# EAGLE design DriverMosfet_2 (EAGLE 7.2.0)
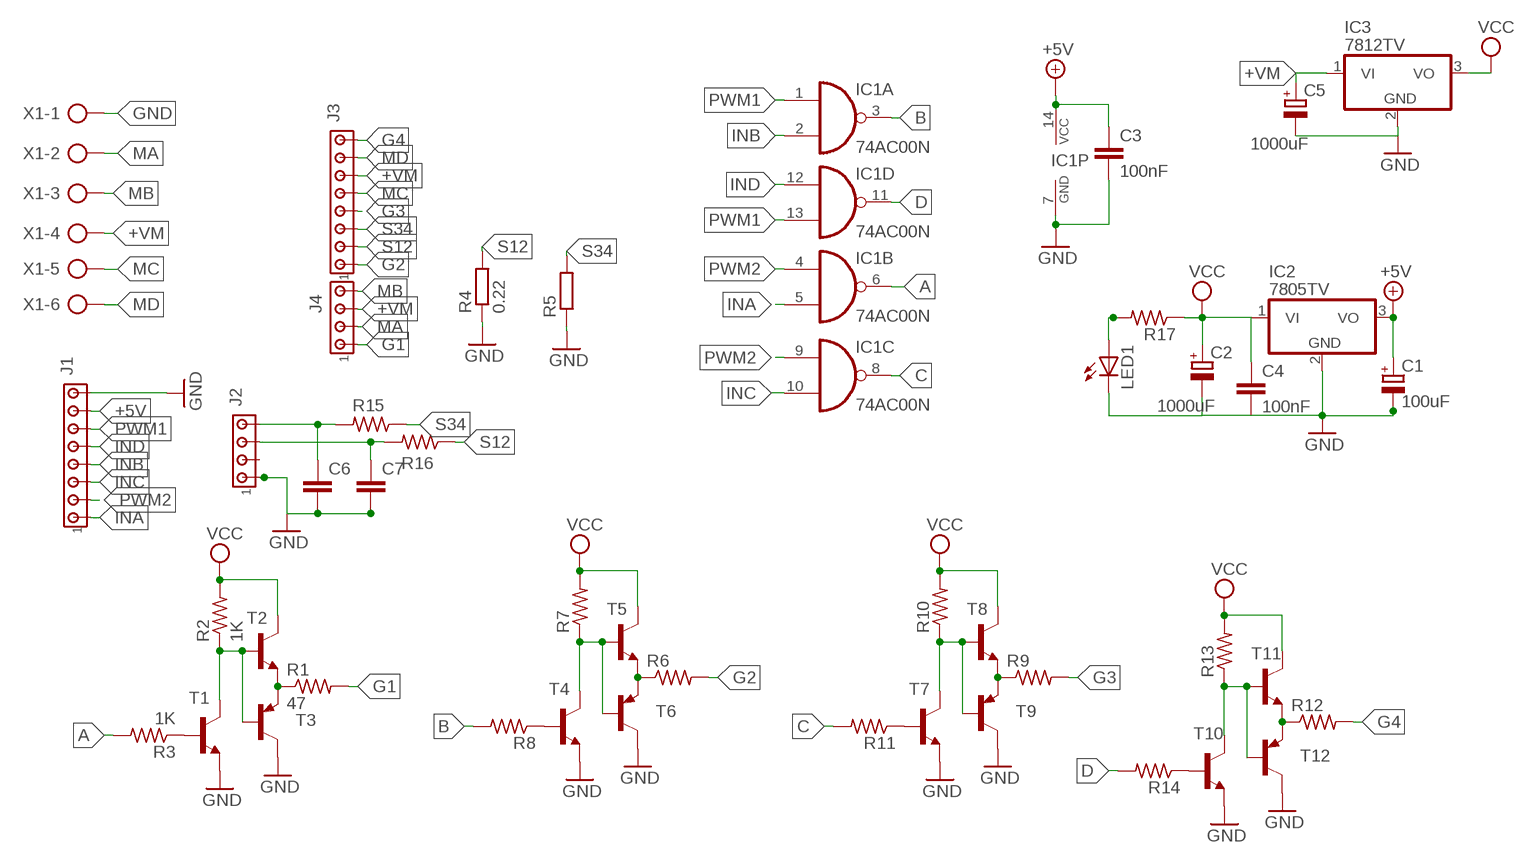
[diagram p0: schematic, sheet 1]

## Parts
C1  100uF  CPOL-EUE2.5-6  [E2,5-6]
C2  1000uF  CPOL-EUE2.5-7  [E2,5-7]
C3  100nF  C-EU050-025X075  [C050-025X075]
C4  100nF  C-EU050-025X075  [C050-025X075]
C5  1000uF  CPOL-EUE3.5-10  [E3,5-10]
C6  C-EU025-030X050  [C025-030X050]
C7  C-EU025-030X050  [C025-030X050]
IC1  74AC00N  [DIL14]
IC2  7805TV  [TO220V]
IC3  7812TV  [TO220V]
J1  MTA08-100  [10X08MTA]
J2  MTA04-100  [10X04MTA]
J3  MTA08-100  [10X08MTA]
J4  MTA04-100  [10X04MTA]
LED1  LED3MM  [LED3MM]
R1  47  R-US_0207/7  [0207/7]
R2  1K  R-US_0207/7  [0207/7]
R3  1K  R-US_0207/7  [0207/7]
R4  0.22  R-EU_0613/15  [P0613/15]
R5  R-EU_0414/15  [0414/15]
R6  R-US_0207/7  [0207/7]
R7  R-US_0207/7  [0207/7]
R8  R-US_0207/7  [0207/7]
R9  R-US_0207/7  [0207/7]
R10  R-US_0207/7  [0207/7]
R11  R-US_0207/7  [0207/7]
R12  R-US_0207/7  [0207/7]
R13  R-US_0207/7  [0207/7]
R14  R-US_0207/7  [0207/7]
R15  R-US_0207/7  [0207/7]
R16  R-US_0207/7  [0207/7]
R17  R-US_0207/7  [0207/7]
T1  BC547-NPN-TO92-CBE  [TO92-CBE]
T2  BC547-NPN-TO92-CBE  [TO92-CBE]
T3  BC557A-PNP-TO92-EBC  [TO92-EBC]
T4  BC547-NPN-TO92-CBE  [TO92-CBE]
T5  BC547-NPN-TO92-CBE  [TO92-CBE]
T6  BC557A-PNP-TO92-EBC  [TO92-EBC]
T7  BC547-NPN-TO92-CBE  [TO92-CBE]
T8  BC547-NPN-TO92-CBE  [TO92-CBE]
T9  BC557A-PNP-TO92-EBC  [TO92-EBC]
T10  BC547-NPN-TO92-CBE  [TO92-CBE]
T11  BC547-NPN-TO92-CBE  [TO92-CBE]
T12  BC557A-PNP-TO92-EBC  [TO92-EBC]
X1  AK500/6-H  [AK500/6-H]

## Nets
+5V: C1.+ C3.1 IC1.14(P:VCC) IC2.3(VO) J1.7
+VM: C5.+ IC3.1(VI) J3.6 J4.3 X1.4
A: IC1.6(B:O) R3.2
B: IC1.3(A:O) R8.2
C: IC1.8(C:O) R11.2
D: IC1.11(D:O) R14.2
G1: J4.1 R1.2
G2: J3.1 R6.2
G3: J3.4 R9.2
G4: J3.8 R12.2
GND: C1.- C2.- C3.2 C4.2 C5.- C6.2 C7.2 IC1.7(P:GND) IC2.2(GND) IC3.2(GND) J1.8 J2.1 LED1.K(C) R4.1 R5.1 T1.E T3.C T4.E T6.C T7.E T9.C T10.E T12.C X1.1
INA: IC1.5(B:I1) J1.1
INB: IC1.2(A:I1) J1.4
INC: IC1.10(C:I1) J1.3
IND: IC1.12(D:I0) J1.5
MA: J4.2 X1.2
MB: J4.4 X1.3
MC: J3.5 X1.5
MD: J3.7 X1.6
N$1: R1.1 T2.E T3.E
N$2: R3.1 T1.B
N$4: C6.1 J2.4 R15.2
N$5: R2.1 T1.C T2.B T3.B
N$6: C7.1 J2.3 R16.2
N$10: R6.1 T5.E T6.E
N$11: R8.1 T4.B
N$13: LED1.A R17.2
N$15: R7.1 T4.C T5.B T6.B
N$19: R9.1 T8.E T9.E
N$20: R11.1 T7.B
N$21: R10.1 T7.C T8.B T9.B
N$25: R12.1 T11.E T12.E
N$26: R14.1 T10.B
N$27: R13.1 T10.C T11.B T12.B
PWM1: IC1.1(A:I0) IC1.13(D:I1) J1.6
PWM2: IC1.4(B:I0) IC1.9(C:I0) J1.2
S12: J3.2 R4.2 R16.1
S34: J3.3 R5.2 R15.1
VCC: C2.+ C4.1 IC2.1(VI) IC3.3(VO) R2.2 R7.2 R10.2 R13.2 R17.1 T2.C T5.C T8.C T11.C
Unconnected: J2.2

## Library data of the parts
C1 C2 C5 = rcl:CPOL-EU: POLARIZED CAPACITOR, European symbol
C3 C4 C6 C7 = rcl:C-EU: CAPACITOR, European symbol
IC1 = 74xx-eu:74*00: Quad 2-input NAND gate
IC2 IC3 = linear:78*: Positive VOLTAGE REGULATOR Source: http://cache.national.com/ds/LM/LM78L05.pdf http://www.fairchildsemi.com/ds/LM/LM7805.pdf
J1 J3 = con-amp:MTA08-100: AMP connector
J2 J4 = con-amp:MTA04-100: AMP connector
LED1 = led:LED: LED OSRAM: - CHIPLED LG R971, LG N971, LY N971, LG Q971, LY Q971, LO R971, LY R971 LH N974, LH R974 LS Q976, LO Q976, LY Q976 LO Q996 - Hyper CHIPLED LW Q18S LB Q993, LB Q99A, LB R99A - SideLED LS A670, LO A670, LY A670, LG A670, LP A670 LB A673, LV A673, LT A673, LW A673 LH A674 LY A675 LS A676, LA A676, LO A676, LY A676, LW A676 LS A679, LY A679, LG A679 - Hyper Micro SIDELED® LS Y876, LA Y876, LO Y876, LY Y876 LT Y87S - SmartLED LW L88C, LW L88S LB L89C, LB L89S, LG L890 LS L89K, LO L89K, LY L89K LS L896, LA L896, LO L896, LY L896 - TOPLED LS T670, LO T670, LY T670, LG T670, LP T670 LSG T670, LSP T670, LSY T670, LOP T670, LYG T670 LG T671, LOG T671, LSG T671 LB T673, LV T673, LT T673, LW T673 LH T674 LS T676, LA T676, LO T676, LY T676, LB T676, LH T676, LSB T676, LW T676 LB T67C, LV T67C, LT T67C, LS T67K, LO T67K, LY T67K, LW E67C LS E67B, LA E67B, LO E67B, LY E67B, LB E67C, LV E67C, LT E67C LW T67C LS T679, LY T679, LG T679 LS T770, LO T770, LY T770, LG T770, LP T770 LB T773, LV T773, LT T773, LW T773 LH T774 LS E675, LA E675, LY E675, LS T675 LS T776, LA T776, LO T776, LY T776, LB T776 LHGB T686 LT T68C, LB T68C - Hyper Mini TOPLED® LB M676 - Mini TOPLED Santana® LG M470 LS M47K, LO M47K, LY M47K Source: http://www.osram.convergy.de LUXEON: - LUMILED® LXK2-PW12-R00, LXK2-PW12-S00, LXK2-PW14-U00, LXK2-PW14-V00 LXK2-PM12-R00, LXK2-PM12-S00, LXK2-PM14-U00 LXK2-PE12-Q00, LXK2-PE12-R00, LXK2-PE12-S00, LXK2-PE14-T00, LXK2-PE14-U00 LXK2-PB12-K00, LXK2-PB12-L00, LXK2-PB12-M00, LXK2-PB14-N00, LXK2-PB14-P00, LXK2-PB14-Q00 LXK2-PR12-L00, LXK2-PR12-M00, LXK2-PR14-Q00, LXK2-PR14-R00 LXK2-PD12-Q00, LXK2-PD12-R00, LXK2-PD12-S00 LXK2-PH12-R00, LXK2-PH12-S00 LXK2-PL12-P00, LXK2-PL12-Q00, LXK2-PL12-R00 Source: www.luxeon.com KINGBRIGHT: KA-3528ASYC Source: www.kingbright.com
R1-R3 R6-R17 = rcl:R-US_: RESISTOR, American symbol; SPICEPREFIX: R
R4 R5 = resistor:R-EU_: RESISTOR, European symbol
T1 T2 T4 T5 T7 T8 T10 T11 = transistor:*-NPN-: NPN Transistror BF959 corrected 2008.03.06
T3 T6 T9 T12 = transistor:*-PNP-: PNP Transistror
X1 = con-ptr500:AK500/6-H: CONNECTOR Aug. 2004 / PTR Meßtechnik: Die Bezeichnung der Serie AK505 wurde geändert. Es handelt sich hierbei um AK500 in horizontaler Ausführung.

## Board
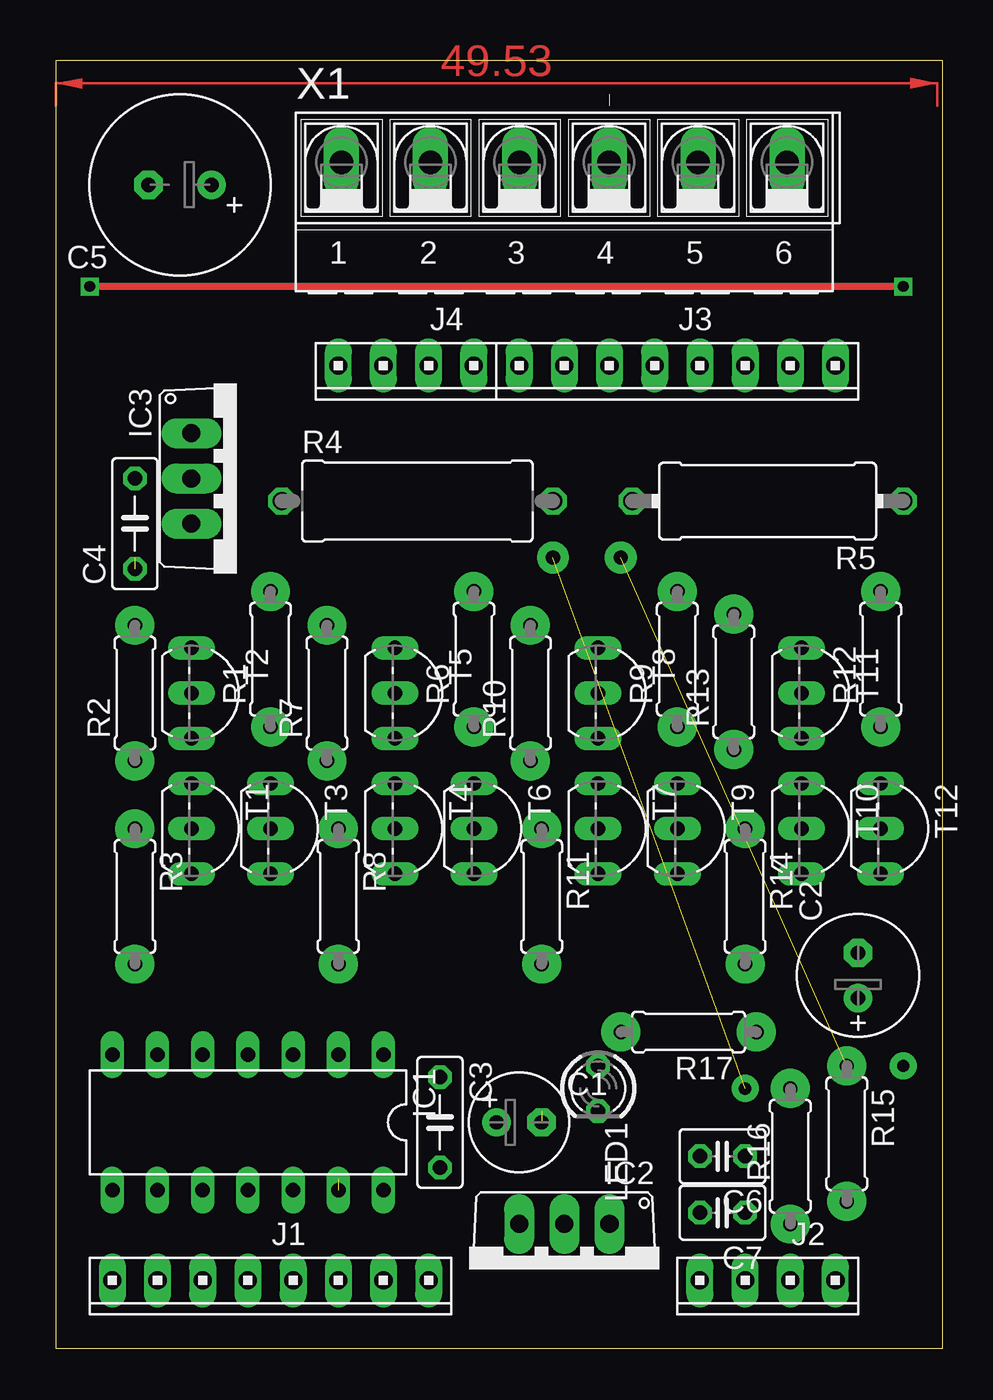
[diagram p1: board, top side]
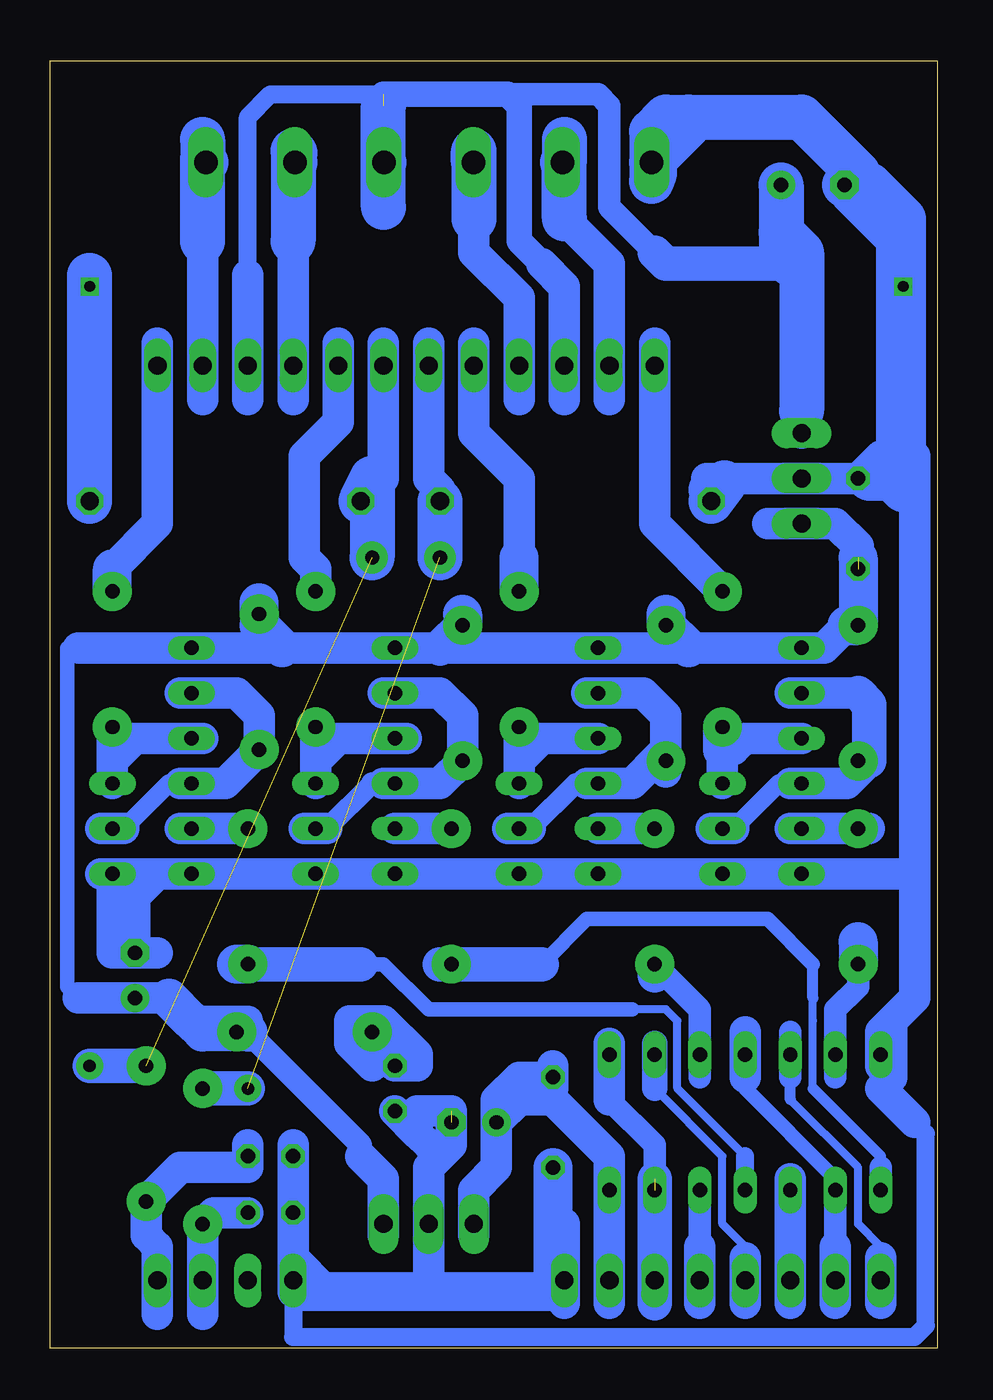
[diagram p2: board, bottom side, seen from below]

Size 49.84 x 72.38 mm. Coordinates in mm from the lower left corner, seen from the top.
Outline: 0,0 49.84,0 49.84,72.38 0,72.38 0,0
Copper layers (1*16): Top 0.035mm / dielectric 1.5mm / Bottom 0.035mm
Design rules "default": minimum track width 10mil, minimum drill 24mil, track to track 8mil, track to pad 8mil, pad to pad 8mil, via to via 8mil, smd to smd 8mil, copper to edge 40mil, drill to drill 8mil, minimum pad ring 10mil, minimum via ring 8mil, stop-mask expansion 4mil, vias tented up to drill 0mil, thermal gap 10mil

### Footprints (pad centres in the part's own frame; a part is rotated, then mirrored left to right if it is on the bottom)
E2,5-6 = drill 0.813 pad 1.6: + -1.27,0 | drill 0.813 pad 1.6 octagon: - 1.27,0
E2,5-7 = drill 0.813 pad 1.6: + -1.27,0 | drill 0.813 pad 1.6 octagon: - 1.27,0
C050-025X075 = drill 0.813 octagon: 1 -2.54,0; 2 2.54,0
E3,5-10 = drill 0.813 pad 1.6: + -1.778,0 | drill 0.813 pad 1.6 octagon: - 1.778,0
C025-030X050 = drill 0.813 octagon: 1 -1.27,0; 2 1.27,0
DIL14 = drill 0.813 long: 1 -7.62,-3.81; 2 -5.08,-3.81; 3 -2.54,-3.81; 4 0,-3.81; 5 2.54,-3.81; 6 5.08,-3.81; 7 7.62,-3.81; 8 7.62,3.81; 9 5.08,3.81; 10 2.54,3.81; 11 0,3.81; 12 -2.54,3.81; 13 -5.08,3.81; 14 -7.62,3.81
TO220V = drill 1.016 pad 1.676 long: 1 -2.54,-2.54; 2 0,-2.54; 3 2.54,-2.54
10X08MTA = drill 1.016 long: 1 8.89,0; 2 6.35,0; 3 3.81,0; 4 1.27,0; 5 -1.27,0; 6 -3.81,0; 7 -6.35,0; 8 -8.89,0
10X04MTA = drill 1.016 long: 1 3.81,0; 2 1.27,0; 3 -1.27,0; 4 -3.81,0
LED3MM = drill 0.813 octagon: A -1.27,0; K 1.27,0
0207/7 = drill 0.813 pad 2.184: 1 -3.81,0; 2 3.81,0
P0613/15 = drill 1.016 octagon: 1 -7.62,0; 2 7.62,0
0414/15 = drill 1.016 octagon: 1 -7.62,0; 2 7.62,0
TO92-CBE = drill 0.813 long: B 0,0; C -2.54,0; E 2.54,0
TO92-EBC = drill 0.813 long: B 0,-1.27; C 2.54,-1.27; E -2.54,-1.27
AK500/6-H = drill 1.321 long: 1 -12.522,0; 2 -7.518,0; 3 -2.515,0; 4 2.515,0; 5 7.518,0; 6 12.522,0

### Placement (x,y rotation side)
C1  26.04,12.7 0 top
C2  45.09,20.96 90 top
C3  21.59,12.7 270 top
C4  4.45,46.35 90 top
C5  6.99,65.41 180 top
C6  37.47,10.79 180 top
C7  37.47,7.62 180 top
IC1  10.79,12.7 180 top
IC2  28.58,4.45 180 top
IC3  10.16,48.89 270 top
J1  12.06,3.81 180 top
J2  40.01,3.81 180 top
J3  34.93,55.24 180 top
J4  19.69,55.24 180 top
LED1  30.48,14.61 270 top
R1  12.06,38.73 90 top
R2  4.45,36.83 90 top
R3  4.45,25.4 270 top
R4  20.32,47.62 0 top
R5  40.01,47.62 180 top
R6  23.5,38.73 90 top
R7  15.24,36.83 90 top
R8  15.87,25.4 270 top
R9  34.93,38.73 90 top
R10  26.67,36.83 90 top
R11  27.3,25.4 270 top
R12  46.36,38.73 90 top
R13  38.1,37.46 90 top
R14  38.73,25.4 270 top
R15  44.45,12.06 270 top
R16  41.27,10.79 270 top
R17  35.56,17.78 180 top
T1  7.62,29.21 270 top
T2  7.62,36.83 270 top
T3  13.33,29.21 270 top
T4  19.05,29.21 270 top
T5  19.05,36.83 270 top
T6  24.77,29.21 270 top
T7  30.48,29.21 270 top
T8  30.48,36.83 270 top
T9  36.2,29.21 270 top
T10  41.91,29.21 270 top
T11  41.91,36.83 270 top
T12  47.62,29.21 270 top
X1  28.58,66.68 0 top

### Tracks (layer width: path | path; a pad name or v marks a point on that pad's centre or on a via)
+5V
  Bottom 1.778: 18.41,2.54 J1.7 IC1.14 18.41,10.79 21.59,13.97 23.5,13.97 C1.+ | 21.59,15.88 C3.1 21.59,14.61 22.23,15.24 23.5,15.24 24.77,13.97 C1.+ | 26.04,6.35 IC2.3 26.04,8.89 24.77,10.16 C1.+
+VM  (1 unrouted)
  Bottom 1.016: 38.73,60.32 38.73,69.22 37.47,70.48 31.12,70.48
  Bottom 1.27: 15.87,61.59 18.41,64.14 18.41,69.85 19.05,70.48 24.13,70.48
  Bottom 1.422: 22.23,60.96 23.5,62.23 23.5,69.85 24.13,70.48 31.12,70.48
  Bottom 1.778: 7.62,52.7 IC3.1 | 38.73,53.34 J3.6 38.73,60.32 | 20.95,53.34 J4.3 20.95,59.69 22.23,60.96
  Bottom 1.93: 8.26,60.96 15.24,60.96 15.87,61.59
  Bottom 2.54: C5.+ 8.76,62.74 | 8.76,62.74 7.62,61.59 7.62,52.7 | 31.12,64.14 31.12,66.65 | 31.12,66.65 X1.4 | 8.76,62.74 8.76,61.47 8.26,60.96 | 31.12,66.65 31.12,69.85
A
  Bottom 1.27: 5.71,15.24 IC1.6 5.71,19.05 4.45,20.32 R3.2
  Bottom 2.184: 4.45,22.86 R3.2
B
  Bottom 1.27: 15.87,20.96 15.24,20.96 13.33,19.05 IC1.3 13.33,15.24
  Bottom 1.93: R8.2 15.87,20.96
C
  Bottom 0.457: 6.99,14.61 6.99,18.42 6.99,19.69
  Bottom 0.61: 3.17,10.16 3.17,10.79 6.99,14.61 | 6.99,19.69 6.99,21.59
  Bottom 0.813: 6.99,21.59 9.53,24.13 19.69,24.13 22.23,21.59
  Bottom 1.27: 3.17,8.26 IC1.8 3.17,10.16
  Bottom 1.93: 22.23,21.59 R11.2 27.94,21.59
D
  Bottom 0.457: 10.79,10.79 14.6,14.61 14.6,18.42 15.24,19.05 17.15,19.05
  Bottom 0.813: 17.15,19.05 28.58,19.05 31.12,21.59 32.38,21.59
  Bottom 1.016: IC1.11 10.79,10.79
  Bottom 1.93: 32.38,21.59 R14.2
  Bottom 2.184: R14.2 39.37,21.59
G1
  Bottom 1.778: 15.87,56.52 J4.1 15.87,46.35 R1.2
G2
  Bottom 1.778: 23.5,44.45 23.5,48.89 26.04,51.43 J3.1 26.04,56.52
  Bottom 2.184: R6.2 23.5,44.45
G3
  Bottom 1.778: R9.2 34.93,43.81 35.56,44.45 35.56,50.16 33.66,52.07 J3.4 33.66,56.52
G4
  Bottom 1.778: 46.36,43.81 43.82,46.35 J3.8 43.82,56.52
  Bottom 2.184: R12.2 46.36,43.81
GND  (via drill 0.6)  (1 unrouted)
  Top 0.406: v47.62,59.69 v1.9,59.69
  Bottom 1.016: 36.2,11.43 36.2,0.64 1.27,0.64 0.63,1.27 0.63,12.06 1.27,12.7
  Bottom 1.778: T12.C 46.99,26.67 | 1.27,26.67 T1.E T3.C T4.E T6.C T7.E T9.C T10.E T12.C | 1.27,26.67 1.27,19.69 2.54,18.42 | 2.54,18.42 3.17,17.78 IC1.7 3.17,15.88 | 28.58,3.17 IC2.2 28.58,10.16 27.3,11.43 27.3,13.33 29.21,13.33 29.21,12.06 | 20.95,2.54 J1.8 20.95,6.98 21.59,7.62 C3.2 | 1.27,26.67 1.27,50.16 3.17,50.16 C4.2 | 3.81,48.89 C4.2 | IC3.2 C4.2 | C4.2 2.54,48.89 2.54,62.23 5.08,64.77 5.08,65.41 | C4.2 12.95,48.89 11.94,48.64 | 36.2,11.43 C6.2 C7.2 | C7.2 36.2,5.08 34.29,3.17 | C7.2 J2.1 36.2,3.17 | 43.82,22.23 C2.- 46.36,22.23 T12.C | T12.C 46.36,24.13 45.09,22.86 45.09,25.4 43.82,26.67 T12.C | 29.21,12.06 28.58,11.43 | 29.21,12.06 LED1.K | 1.27,12.7 3.17,14.61 2.54,15.24 2.54,18.42
  Bottom 2.184: C3.2 21.59,3.17 28.58,3.17 34.29,3.17 35.56,3.17
  Bottom 2.54: 12.7,48.26 11.94,48.64 R4.1 | R5.1 v47.62,59.69 47.62,60.32 | C5.- 5.08,65.41 4.45,65.41 | 4.45,65.41 3.81,65.41 1.9,63.5 v1.9,59.69 1.9,48.26 2.54,48.89 3.81,48.89 | 13.97,69.22 15.24,69.22 16.05,68.4 X1.1 | 13.97,69.22 7.62,69.22 4.45,66.04 4.45,65.41 | X1.1 16.05,65.58 15.87,66.04 15.87,67.31 13.97,69.22 | 13.97,69.22 13.97,68.76 X1.1
INA
  Bottom 0.457: 3.17,5.08 3.17,5.71 4.45,6.98 4.45,10.16 8.26,13.97
  Bottom 0.61: 8.26,13.97 8.26,15.24
  Bottom 1.27: 8.26,15.24 IC1.5 8.26,17.78
  Bottom 1.778: 3.17,2.54 J1.1 3.17,5.08
INB
  Bottom 0.457: 10.79,5.08 10.79,5.71 12.06,6.98 12.06,10.79 15.87,14.61
  Bottom 1.422: 15.87,14.61 IC1.2 15.87,17.15
  Bottom 1.778: 10.79,2.54 J1.4 10.79,5.08
INC
  Bottom 1.778: 8.26,2.54 J1.3 IC1.10 8.26,9.53
IND
  Bottom 1.27: IC1.12 13.33,5.71
  Bottom 1.778: 13.33,5.71 J1.5 13.33,2.54
MA
  Bottom 1.778: 18.41,53.34 J4.2 18.41,60.96 20.95,63.5
  Bottom 2.54: 20.95,63.5 20.95,66.78 | 20.95,67.95 20.95,66.78 | 20.95,66.78 X1.2
MB
  Bottom 1.778: 26.04,63.5 26.04,61.59 23.5,59.05 J4.4 23.5,53.34
  Bottom 2.54: X1.3 26.06,67.29 26.04,67.31 26.04,63.5
MC
  Bottom 1.778: 36.2,62.23 J3.5 36.2,53.34
  Bottom 2.54: X1.5 36.09,67.21 36.2,67.31 36.2,62.23
MD
  Bottom 1.778: 41.27,53.34 J3.7 41.27,62.23
  Bottom 2.54: 41.27,62.23 41.27,66.85 | 41.27,67.95 41.27,66.85 | 41.27,66.85 X1.6
N$1
  Bottom 1.778: T3.E 12.06,33.66 11.43,33.66 10.79,34.29 T2.E
  Bottom 2.184: R1.1 12.06,33.66
N$2
  Bottom 1.778: 8.26,29.21 T1.B R3.1 3.81,29.21
N$3  (via drill 0.8 pad 1.78)
  other vias: 27.94,44.45
N$4
  Bottom 1.778: 38.73,11.43 C6.1 38.73,10.16 42.55,10.16 R15.2 44.45,6.35 43.82,5.71 J2.4 43.82,1.91
N$5
  Bottom 1.016: 11.43,29.21 8.89,31.75 8.26,31.75
  Bottom 1.778: 12.7,29.21 T3.B 11.43,29.21 | 8.26,31.75 T1.C | T1.C 6.99,31.75 | 4.45,36.83 T2.B 8.26,36.83 | T1.C 5.08,31.75 3.81,33.02
  Bottom 1.93: R2.1 3.81,33.02 3.81,36.2 4.45,36.83
N$6
  Bottom 1.778: 41.27,1.91 J2.3 R16.2 40.64,7.62 C7.1
N$8  (via drill 0.8 pad 1.78)
  other vias: 31.75,44.45
N$9  (via drill 0.7 pad 1.52)
  other vias: 38.73,14.61
N$10
  Bottom 1.778: T6.E 23.5,33.02 | 23.5,33.02 R6.1 | T5.E 22.23,34.29 23.5,33.02
N$11
  Bottom 1.778: T4.B R8.1
N$12  (via drill 0.7 pad 1.52)
  other vias: 47.62,15.88
N$13
  Bottom 1.778: LED1.A 29.21,15.88 29.21,16.51 31.12,18.42 33.02,18.42 33.02,17.15 31.75,15.88 31.12,16.51 31.12,17.15 R17.2
N$15
  Bottom 1.143: 19.69,31.75 20.32,31.75 22.86,29.21
  Bottom 1.778: 15.56,33.34 17.15,31.75 T4.C 19.69,31.75 | 15.56,33.34 15.24,33.66 15.24,35.56 16.51,36.83 T5.B 19.69,36.83 | 15.24,32.38 R7.1 15.56,33.34 | 24.13,29.21 T6.B 22.86,29.21
N$19
  Bottom 1.778: R9.1 34.93,33.02 | 34.93,33.02 T9.E | 29.84,34.29 T8.E 33.66,34.29 34.93,33.02
N$20
  Bottom 1.778: T7.B R11.1
N$21
  Bottom 1.143: 34.29,29.21 31.75,31.75
  Bottom 1.27: 31.75,31.75 31.12,31.75
  Bottom 1.778: 31.12,31.75 T7.C 27.94,31.75 R10.1 26.67,35.56 27.94,36.83 T8.B 31.12,36.83 | 35.56,29.21 T9.B 34.29,29.21
N$25
  Bottom 1.778: T12.E 46.36,33.02 | 46.36,33.02 R12.1 | 41.27,34.29 T11.E 45.09,34.29 46.36,33.02
N$26
  Bottom 1.778: 42.55,29.21 T10.B R14.1
N$27
  Bottom 1.016: 45.72,29.21 43.18,31.75 42.55,31.75
  Bottom 1.778: 42.55,36.83 T11.B 39.37,36.83 38.1,35.56 R13.1 40.01,31.75 T10.C 42.55,31.75 | 46.99,29.21 T12.B 45.72,29.21
PWM1  (1 unrouted)
  Bottom 1.27: 15.87,9.53 15.87,11.43 18.41,13.97
  Bottom 1.778: 18.41,13.97 IC1.1 18.41,17.15
  Bottom 1.93: 15.87,2.54 J1.6 15.87,9.53
PWM2
  Bottom 0.813: 10.79,15.24 10.79,14.61 5.71,9.53 IC1.9
  Bottom 1.27: IC1.9 5.71,5.71
  Bottom 1.778: 5.71,5.71 J1.2 5.71,2.54 | 10.79,17.78 IC1.4 10.79,15.24
S12  (1 unrouted)
  Bottom 1.778: 28.58,56.52 J3.2 28.58,48.89 27.94,48.26 27.94,46.99
  Bottom 1.93: R16.1 38.73,14.61
  Bottom 2.54: R4.2 27.94,46.99 27.94,44.45
S34  (1 unrouted)
  Bottom 1.778: 31.12,56.52 J3.3 31.12,48.89 31.75,48.26
  Bottom 1.93: R15.1 47.62,15.88
  Bottom 2.54: R5.2 31.75,48.89 31.75,48.26 31.75,44.45
VCC  (1 unrouted)
  Bottom 0.813: 48.26,19.69 48.9,20.32 48.9,39.37 48.26,39.37
  Bottom 1.27: 32.38,10.79 32.38,11.43 38.73,17.78
  Bottom 1.676: 38.73,17.78 38.73,18.42 41.91,18.42
  Bottom 1.778: 42.55,39.37 T11.C | 5.08,40.64 6.35,39.37 T2.C 13.97,39.37 T5.C 27.94,39.37 T8.C 36.83,39.37 T11.C | 48.26,19.69 C2.+ 43.18,19.69 | 48.26,39.37 T11.C | 9.53,46.35 IC3.3 5.71,46.35 4.45,45.09 4.45,44.45 | 31.12,6.35 IC2.1 31.12,9.53 32.38,10.79
  Bottom 2.032: R10.2 27.94,39.37
  Bottom 2.184: 38.1,41.91 R13.2 38.1,40.64 36.83,39.37 | 26.67,41.27 R10.2 | 15.24,41.27 R7.2 13.97,39.37 | 5.08,40.64 R2.2 4.45,44.45 | 38.73,17.78 R17.1 41.27,17.78 41.91,18.42 43.18,19.69
(copper drawn outside any net)
  shapes: Top area x1